# EAGLE design Door lock REV B (EAGLE 7.5.0)
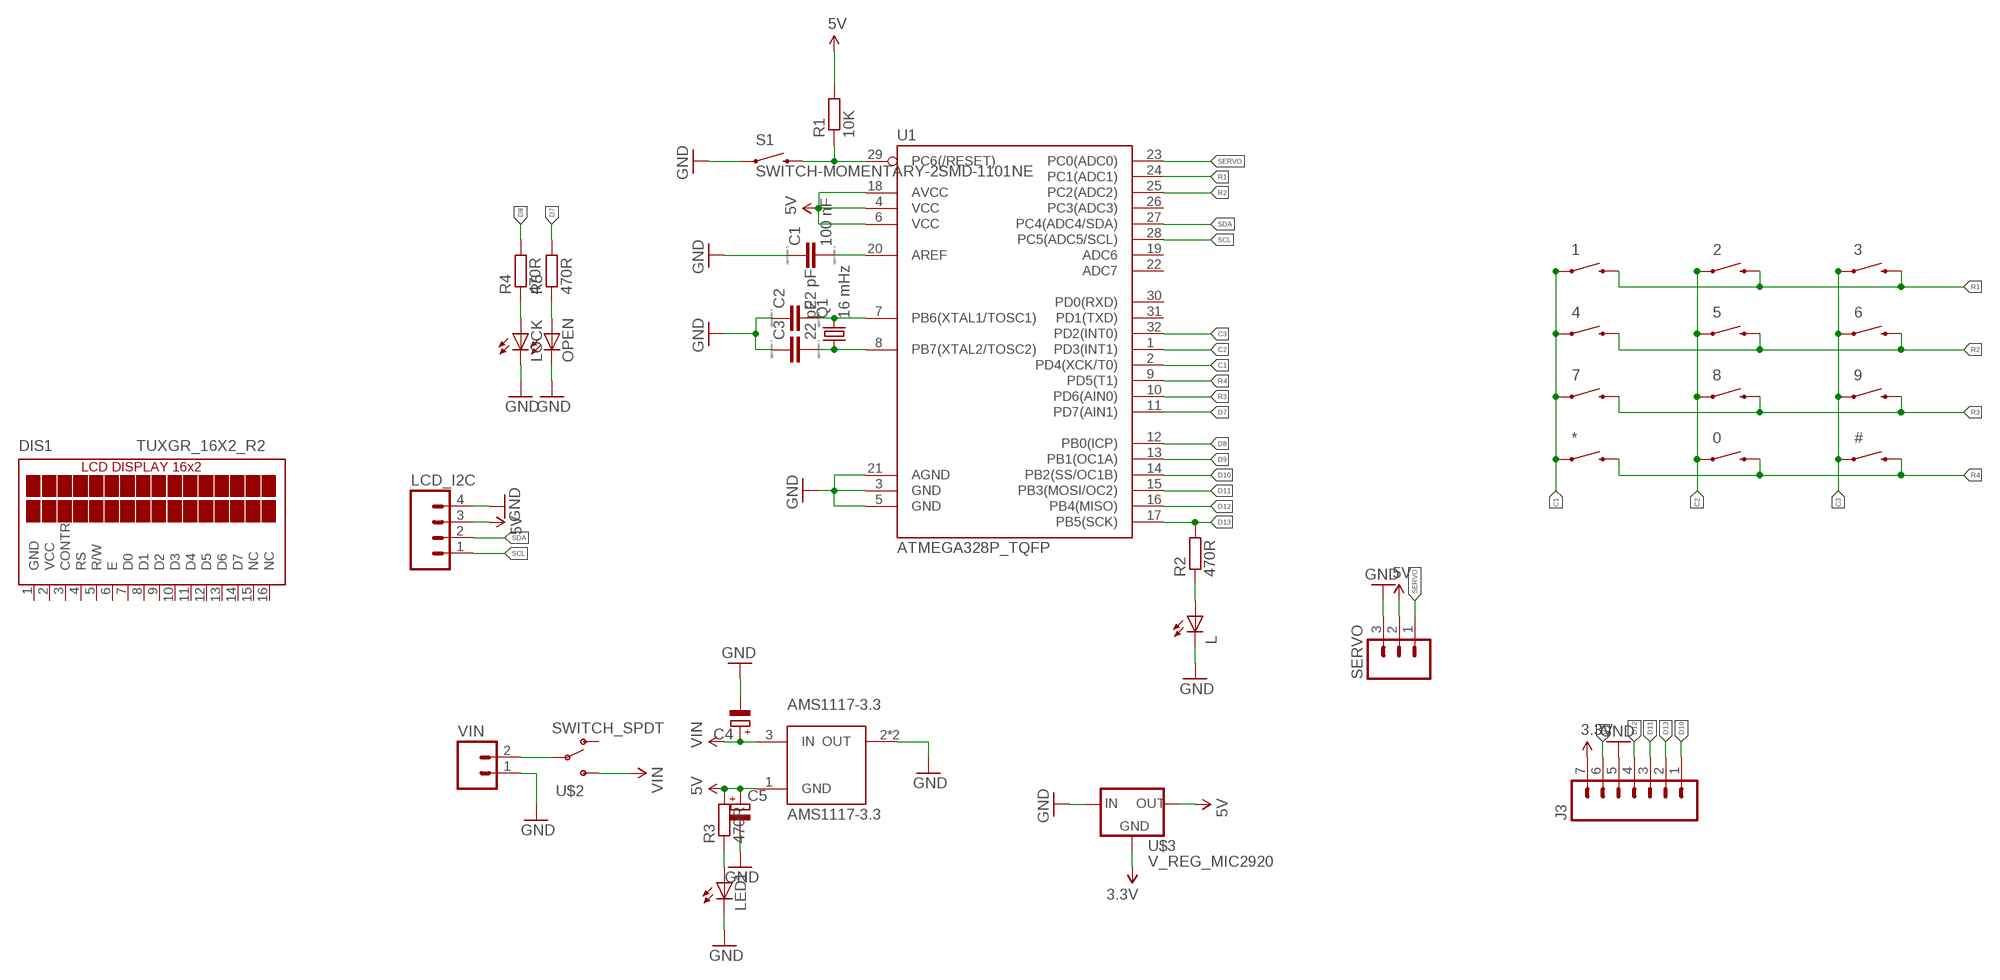
[diagram p0: schematic, sheet 1]

## Parts
0  SWITCH-MOMENTARY-2PTH  [TACTILE-PTH]
1  SWITCH-MOMENTARY-2PTH  [TACTILE-PTH]
2  SWITCH-MOMENTARY-2PTH  [TACTILE-PTH]
3  SWITCH-MOMENTARY-2PTH  [TACTILE-PTH]
4  SWITCH-MOMENTARY-2PTH  [TACTILE-PTH]
5  SWITCH-MOMENTARY-2PTH  [TACTILE-PTH]
6  SWITCH-MOMENTARY-2PTH  [TACTILE-PTH]
7  SWITCH-MOMENTARY-2PTH  [TACTILE-PTH]
8  SWITCH-MOMENTARY-2PTH  [TACTILE-PTH]
9  SWITCH-MOMENTARY-2PTH  [TACTILE-PTH]
#  SWITCH-MOMENTARY-2PTH  [TACTILE-PTH]
*  SWITCH-MOMENTARY-2PTH  [TACTILE-PTH]
AMS1117-3.3  AMS1117-3.3  AP1117Y33G-13  [SOT89]
C1  100 nF  CC0603  [C0603]
C2  22 pF  CC0603  [C0603]
C3  22 pF  CC0603  [C0603]
C4  CPOL-EUSMCA  [SMC_A]
C5  CPOL-EUSMCA  [SMC_A]
DIS1  TUXGR_16X2_R2  [TUXGR_16X2_R2]
J3  M07  [1X07]
L  LEDCHIPLED_0805  [CHIPLED_0805]
LCD_I2C  M04PTH  [1X04]
LED1  LEDCHIPLED_0805  [CHIPLED_0805]
LOCK  LED3MM  [LED3MM]
OPEN  LED3MM  [LED3MM]
Q1  16 mHz  CRYSTALHC49S  [HC49/S]
R1  10K  R-EU_R0603  [R0603]
R2  470R  R-EU_R0603  [R0603]
R3  470R  R-EU_R0603  [R0603]
R4  470R  R-EU_R0603  [R0603]
R5  470R  R-EU_R0603  [R0603]
S1  SWITCH-MOMENTARY-2SMD-1101NE  [TACTILE-SWITCH-1101NE]
SERVO  M03PTH  [1X03]
U1  ATMEGA328P_TQFP  [TQFP32-08]
U$2  SWITCH_SPDT  [KPS-1290]
U$3  V_REG_MIC2920  [SOT223]
VIN  M02PTH3  [1X02_LONGPADS]

## Nets
3.3V: J3.7 U$3.2(GND)
5V: AMS1117-3.3.1(GND) C5.+ LCD_I2C.3 R1.2 R3.2 SERVO.2 U1.4(VCC) U1.6(VCC) U1.18(AVCC) U$3.3(OUT)
C1: 1.1 4.1 7.1 *.1 U1.2(PD4(XCK/T0))
C2: 0.1 2.1 5.1 8.1 U1.1(PD3(INT1))
C3: 3.1 6.1 9.1 #.1 U1.32(PD2(INT0))
D7: R5.2 U1.11(PD7(AIN1))
D8: R4.2 U1.12(PB0(ICP))
D9: J3.6 U1.13(PB1(OC1A))
D10: J3.1 U1.14(PB2(SS/OC1B))
D11: J3.3 U1.15(PB3(MOSI/OC2))
D12: J3.4 U1.16(PB4(MISO))
D13: J3.2 R2.2 U1.17(PB5(SCK))
GND: AMS1117-3.3.2(OUT) AMS1117-3.3.2@1(OUT) C1.1 C2.1 C3.1 C4.- C5.- J3.5 L.C LCD_I2C.4 LED1.C LOCK.K(C) OPEN.K(C) S1.1 SERVO.3 U1.3(GND) U1.5(GND) U1.21(AGND) U$3.1(IN) VIN.1
N$1: L.A R2.1
N$2: LOCK.A R4.1
N$3: C3.2 Q1.1 U1.8(PB7(XTAL2/TOSC2))
N$4: C2.2 Q1.2 U1.7(PB6(XTAL1/TOSC1))
N$5: OPEN.A R5.1
N$6: C1.2 U1.20(AREF)
N$7: R1.1 S1.2 U1.29(PC6(/RESET))
N$9: LED1.A R3.1
N$11: U$2.P VIN.2
R1: 1.3 2.3 3.3 U1.24(PC1(ADC1))
R2: 4.3 5.3 6.3 U1.25(PC2(ADC2))
R3: 7.3 8.3 9.3 U1.10(PD6(AIN0))
R4: 0.3 #.3 *.3 U1.9(PD5(T1))
SCL: LCD_I2C.1 U1.28(PC5(ADC5/SCL))
SDA: LCD_I2C.2 U1.27(PC4(ADC4/SDA))
SERVO: SERVO.1 U1.23(PC0(ADC0))
VIN: AMS1117-3.3.3(IN) C4.+ U$2.S
Unconnected: DIS1.3(CONTR) DIS1.4(RS) DIS1.5(R/W) DIS1.6(E) DIS1.7(D0) DIS1.8(D1) DIS1.9(D2) DIS1.10(D3) DIS1.11(D4) DIS1.12(D5) DIS1.13(D6) DIS1.14(D7) DIS1.15(NC) DIS1.16(NC) U1.19(ADC6) U1.22(ADC7) U1.26(PC3(ADC3)) U1.30(PD0(RXD)) U1.31(PD1(TXD)) U$2.O

## Power pins joined to a net without a drawn wire
GND: DIS1.1(GND)
VCC: DIS1.2(VCC)

## Library data of the parts
0 1-9 # * = SparkFun-Electromechanical:SWITCH-MOMENTARY-2: Various NO switches- pushbuttons, reed, etc; PROD_ID: SWCH-08441
AMS1117-3.3 = AP1117Y33G-13:AP1117Y33G-13
C1-C3 = eagle-ltspice:C: CAPACITOR, European symbol; SPICEMODEL: NONE; SPICEPREFIX: C
C4 C5 = rcl:CPOL-EU: POLARIZED CAPACITOR, European symbol
DIS1 = display-lcd:TUXGR_16X2_R2: Tuxgraphics LCD display 16x2 characters reflective, without background light Source: tuxgr_12x2_r2.pdf; OC_FARNELL: unknown; OC_NEWARK: unknown
J3 = SparkFun-Connectors:M07: Header 7 Standard 7-pin 0.1" header. Use with straight break away headers (SKU : PRT-00116), right angle break away headers (PRT-00553), swiss pins (PRT-00743), machine pins (PRT-00117), and female headers (PRT-00115). NOTES ON THE VARIANTS LOCK and LOCK_LONGPADS... This footprint was designed to help hold the alignment of a through-hole component (i.e. 7-pin header) while soldering it into place. You may notice that each hole has been shifted either up or down by 0.005 of an inch from it's more standard position (which is usually a perfectly straight line). This slight alteration caused the pins (the squares in the middle) to touch the edges of the holes. Because they are alternating, it causes a "brace" to hold the header in place. 0.005 has proven to be the perfect amount of "off-center" position when using our standard breakaway headers. Although looks a little odd when you look at the bare footprint, once you have a header in there, the alteration is very hard to notice. Also, if you push a header all the way into place, it is covered up entirely on the bottom side. This idea of altering the position of holes to aid alignment will be further integrated into the Sparkfun Library for other footprints. It can help hold any component with 3 or more connection pins.
L LED1 LOCK OPEN = adafruit:LED: LED OSRAM: - CHIPLED LG R971, LG N971, LY N971, LG Q971, LY Q971, LO R971, LY R971 LH N974, LH R974 LS Q976, LO Q976, LY Q976 LO Q996 - Hyper CHIPLED LW Q18S LB Q993, LB Q99A, LB R99A - SideLED LS A670, LO A670, LY A670, LG A670, LP A670 LB A673, LV A673, LT A673, LW A673 LH A674 LY A675 LS A676, LA A676, LO A676, LY A676, LW A676 LS A679, LY A679, LG A679 - Hyper Micro SIDELED® LS Y876, LA Y876, LO Y876, LY Y876 LT Y87S - SmartLED LW L88C, LW L88S LB L89C, LB L89S, LG L890 LS L89K, LO L89K, LY L89K LS L896, LA L896, LO L896, LY L896 - TOPLED LS T670, LO T670, LY T670, LG T670, LP T670 LSG T670, LSP T670, LSY T670, LOP T670, LYG T670 LG T671, LOG T671, LSG T671 LB T673, LV T673, LT T673, LW T673 LH T674 LS T676, LA T676, LO T676, LY T676, LB T676, LH T676, LSB T676, LW T676 LB T67C, LV T67C, LT T67C, LS T67K, LO T67K, LY T67K, LW E67C LS E67B, LA E67B, LO E67B, LY E67B, LB E67C, LV E67C, LT E67C LW T67C LS T679, LY T679, LG T679 LS T770, LO T770, LY T770, LG T770, LP T770 LB T773, LV T773, LT T773, LW T773 LH T774 LS E675, LA E675, LY E675, LS T675 LS T776, LA T776, LO T776, LY T776, LB T776 LHGB T686 LT T68C, LB T68C - Hyper Mini TOPLED® LB M676 - Mini TOPLED Santana® LG M470 LS M47K, LO M47K, LY M47K Source: http://www.osram.convergy.de/
LCD_I2C = SparkFun-Connectors:M04: Header 4 Standard 4-pin 0.1" header. Use with straight break away headers (SKU : PRT-00116), right angle break away headers (PRT-00553), swiss pins (PRT-00743), machine pins (PRT-00117), and female headers (PRT-00115). Molex polarized connector foot print use with SKU : PRT-08231 with associated crimp pins and housings. 1MM SMD Version SKU: PRT-10208; PROD_ID: CONN-09696
Q1 = adafruit:CRYSTAL: CRYSTAL; OC_FARNELL: 1667008; OC_NEWARK: unknown
R1-R5 = rcl:R-EU_: RESISTOR, European symbol
S1 = SparkFun-Electromechanical:SWITCH-MOMENTARY-2: Various NO switches- pushbuttons, reed, etc; PROD_ID: SWCH-00815
SERVO = SparkFun-Connectors:M03: Header 3 Standard 3-pin 0.1" header. Use with straight break away headers (SKU : PRT-00116), right angle break away headers (PRT-00553), swiss pins (PRT-00743), machine pins (PRT-00117), and female headers (PRT-00115). Molex polarized connector foot print use with SKU : PRT-08232 with associated crimp pins and housings.
U1 = SparkFun-DigitalIC:ATMEGA328P_TQFP; PROD_ID: IC-09069
U$2 = SparkFun-Electromechanical:SWITCH_SPDT: SWCH-10651 Side-actuated SPDT slide switch, as used on the Arduino Pro; PROD_ID: SWCH-10651
U$3 = SparkFun-PowerIC:V_REG_MIC2920: MIC2920A (http://www.micrel.com/_PDF/mic2920.pdf) - 400mA output LDO Regulator
VIN = SparkFun-Connectors:M02: Standard 2-pin 0.1" header. Use with - straight break away headers ( PRT-00116) - right angle break away headers (PRT-00553) - swiss pins (PRT-00743) - machine pins (PRT-00117) - female headers (PRT-00115) Molex polarized connector foot print use with: PRT-08233 with associated crimp pins and housings. 2.54_SCREWTERM for use with PRT-10571. 3.5mm Screw Terminal footprints for PRT-08084 5mm Screw Terminal footprints for use with PRT-08432

## Board
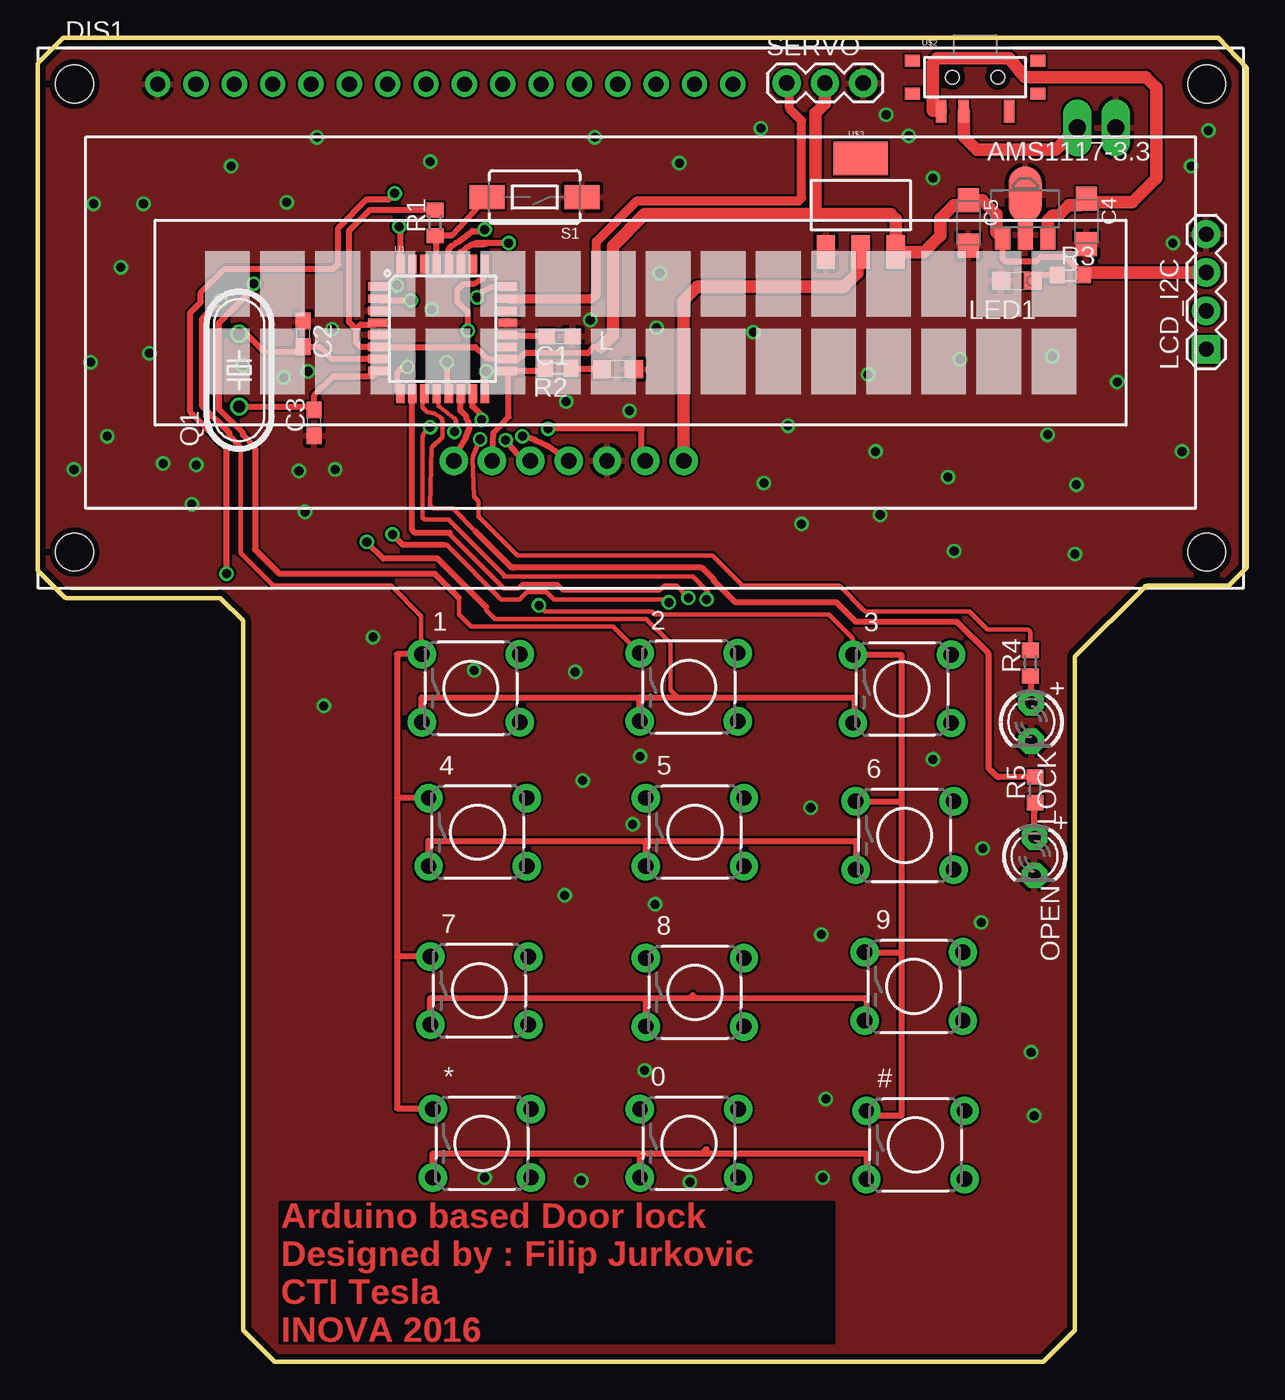
[diagram p1: board, top side]
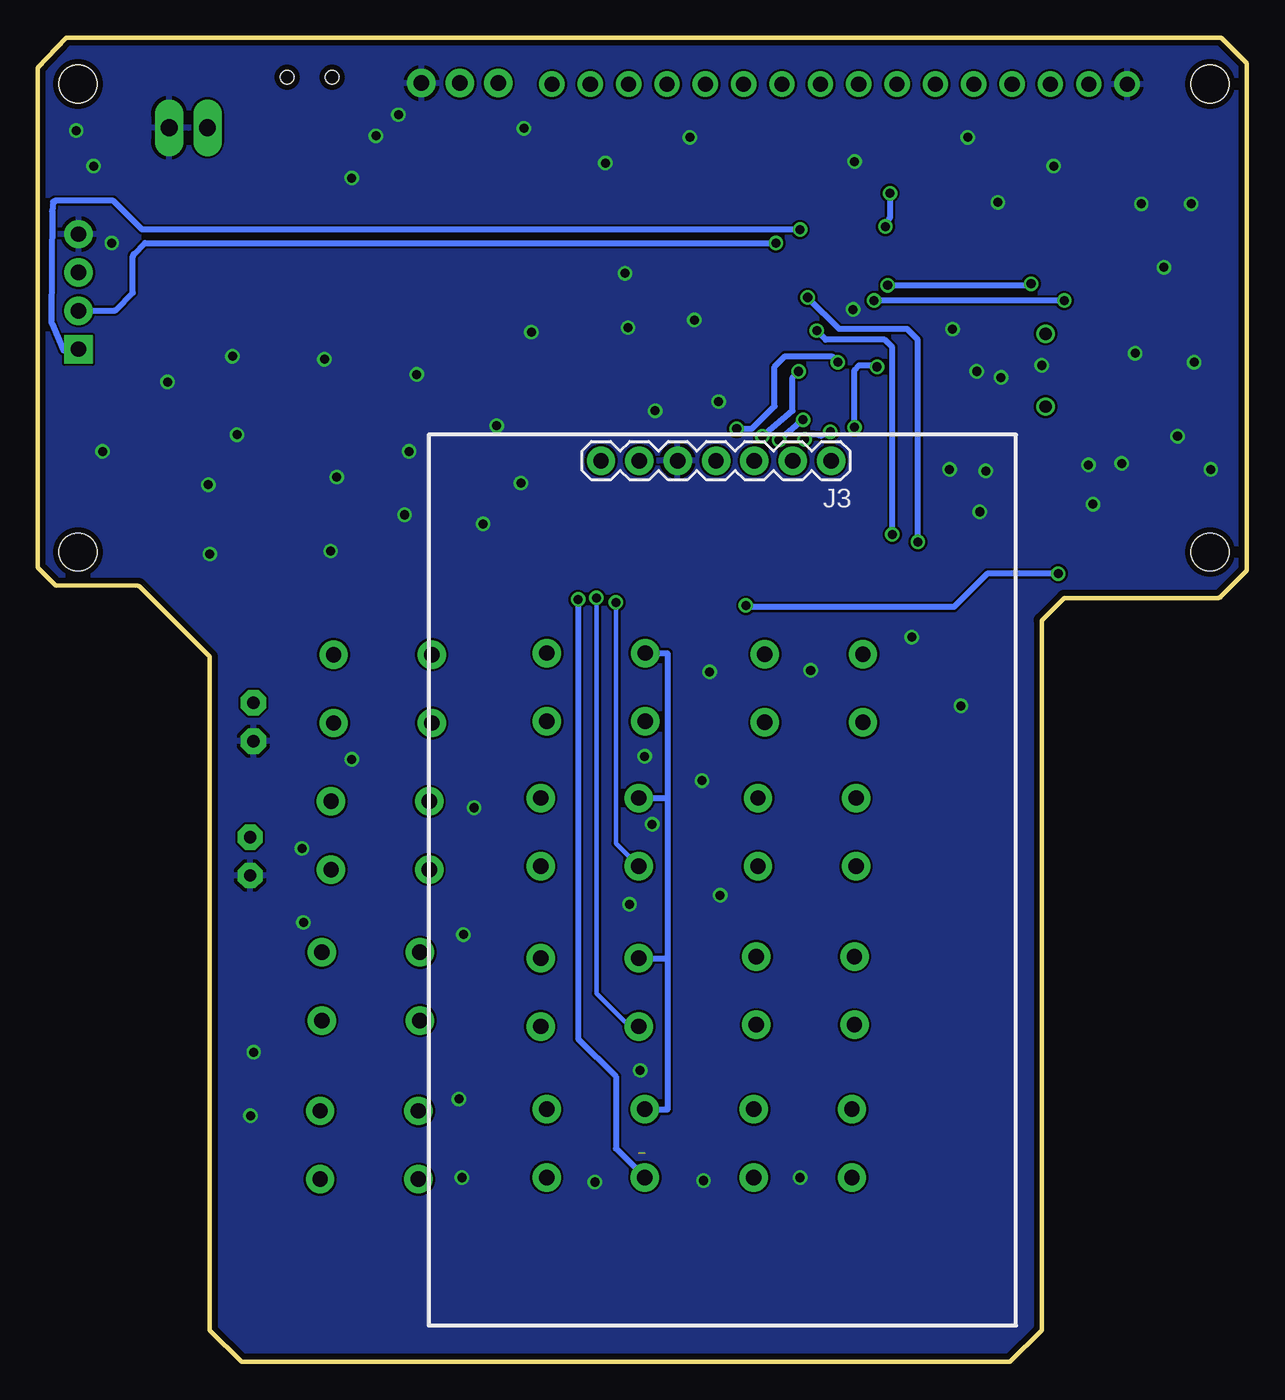
[diagram p2: board, bottom side, seen from below]

Size 80.1 x 87.7 mm. Coordinates in mm from the lower left corner, seen from the top.
Outline: 1.9,50.6 arc-45 1.73,50.67 0,52.4 0,85.89 arc-45 0.07,86.07 1.7,87.7 78.2,87.7 80.1,85.7 80.1,52.6 78.9,51.4 73.51,51.4 arc45 73.33,51.33 68.7,46.7 68.7,2.1 66.6,0 15.7,0 13.6,2.1 13.6,2.2 13.6,49.1 12.1,50.6 2,50.6
Copper layers (1*16): Top 0.0356mm / dielectric 1.5011mm / Bottom 0.0356mm
Design rules "PCBs_io": minimum track width 6mil, minimum drill 13mil, track to track 6mil, track to pad 6mil, pad to pad 6mil, via to via 6mil, smd to smd 6mil, copper to edge 15mil, drill to drill 6mil, minimum pad ring 7mil, minimum via ring 7mil, stop-mask expansion 3mil, vias tented up to drill 0mil, thermal gap 10mil

### Footprints (pad centres in the part's own frame; a part is rotated, then mirrored left to right if it is on the bottom)
TACTILE-PTH = drill 1.016 pad 1.88: 1 -3.251,2.261; 2 3.251,2.261; 3 -3.251,-2.261; 4 3.251,-2.261
SOT89 = smd 1 x 1.5: 1 -1.499,-1.981; 3 1.499,-1.981 | smd 1 x 2: 2 0,-1.727 | smd 2.2 x 3.7: 2@1 0,0.94
C0603 = smd 1.1 x 1: 1 -0.85,0; 2 0.85,0
SMC_A = smd 1.6 x 1.4: + -1.5,0; - 1.5,0
TUXGR_16X2_R2 = drill 1 pad 1.676: 1 -32,15.5; 2 -29.46,15.5; 3 -26.92,15.5; 4 -24.38,15.5; 5 -21.84,15.5; 6 -19.3,15.5; 7 -16.76,15.5; 8 -14.22,15.5; 9 -11.68,15.5; 10 -9.14,15.5; 11 -6.6,15.5; 12 -4.06,15.5; 13 -1.52,15.5; 14 1.02,15.5; 15 3.56,15.5; 16 6.1,15.5 | hole 2.5: -37.5,-15.5; 37.5,-15.5; -37.5,15.5; 37.5,15.5
1X07 = drill 1.016 pad 1.88: 1 0,0; 2 2.54,0; 3 5.08,0; 4 7.62,0; 5 10.16,0; 6 12.7,0; 7 15.24,0
CHIPLED_0805 = smd 1.2 x 1.2: A 0,-1.05; C 0,1.05
1X04 = drill 1.016 pad 1.88 square: 1 0,0 | drill 1.016 pad 1.88: 2 2.54,0; 3 5.08,0; 4 7.62,0
LED3MM = drill 0.813 pad 1.676 octagon: A -1.27,0; K 1.27,0
HC49/S = drill 0.813: 1 -2.413,0; 2 2.413,0
R0603 = smd 1 x 1.1: 1 -0.85,0; 2 0.85,0
TACTILE-SWITCH-1101NE = smd 2.3 x 1.6: 1 -3.15,0; 2 3.15,0
1X03 = drill 1.016 pad 1.88: 1 0,0; 2 2.54,0; 3 5.08,0
TQFP32-08 = smd 1.27 x 0.559: 1 -4.293,2.8; 2 -4.293,2; 3 -4.293,1.2; 4 -4.293,0.4; 5 -4.293,-0.4; 6 -4.293,-1.2; 7 -4.293,-2; 8 -4.293,-2.8; 17 4.293,-2.8; 18 4.293,-2; 19 4.293,-1.2; 20 4.293,-0.4; 21 4.293,0.4; 22 4.293,1.2; 23 4.293,2; 24 4.293,2.8 | smd 0.559 x 1.27: 9 -2.8,-4.293; 10 -2,-4.293; 11 -1.2,-4.293; 12 -0.4,-4.293; 13 0.4,-4.293; 14 1.2,-4.293; 15 2,-4.293; 16 2.8,-4.293; 25 2.8,4.293; 26 2,4.293; 27 1.2,4.293; 28 0.4,4.293; 29 -0.4,4.293; 30 -1.2,4.293; 31 -2,4.293; 32 -2.8,4.293
KPS-1290 = smd 0.7 x 1.5: O -2.25,2.25; P 0.75,2.25; S 2.25,2.25 | smd 1 x 0.8: P$1 -4.15,1.1; P$2 -4.15,-1.1; P$3 4.15,-1.1; P$4 4.15,1.1 | hole 0.9: -1.5,0; 1.5,0
SOT223 = smd 1.219 x 2.235: 1 -2.311,-3.099; 2 0,-3.099; 3 2.311,-3.099 | smd 3.6 x 2.2: 4 0,3.099
1X02_LONGPADS = drill 1.118 pad 1.88 long: 1 0,0; 2 2.54,0

### Placement (x,y rotation side)
0  43.14,14.47 0 top
1  28.69,44.61 0 top
2  43.12,44.68 0 top
3  57.25,44.57 0 top
4  29.14,35.08 0 top
5  43.53,35.08 0 top
6  57.42,34.86 0 top
7  29.25,24.58 0 top
8  43.53,24.47 0 top
9  58.03,24.86 0 top
#  58.14,14.36 0 top
*  29.42,14.47 0 top
AMS1117-3.3  65.41,76.38 0 top
C1  34.58,67.92 180 top
C2  17.58,68.09 270 top
C3  18.32,62.2 90 top
C4  69.46,75.53 270 top
C5  61.65,75.43 270 top
DIS1  39.94,69.13 0 top
J3  27.55,59.68 180 bottom
L  38.43,65.75 270 top
LCD_I2C  77.4,67.07 90 top
LED1  64.87,71.6 90 top
LOCK  65.81,42.38 270 top
OPEN  66.03,33.48 270 top
Q1  13.34,65.68 90 top
R1  26.32,75.44 90 top
R2  34.47,65.82 180 top
R3  68.4,71.98 0 top
R4  65.75,46.28 90 top
R5  66.06,37.88 90 top
S1  32.91,77.15 180 top
SERVO  49.6,84.7 0 top
U1  26.82,68.42 0 top
U$2  62.09,85.08 180 top
U$3  54.52,76.61 0 top
VIN  71.4,81.73 180 top

### Tracks (layer width: path | path; a pad name or v marks a point on that pad's centre or on a via)
3.3V
  Top 0.813: J3.7 42.79,70.29 43.7,71.2 53.4,71.2 54.3,72.1 54.3,73.29 U$3.2
5V
  Top 0.406: 21.1,68.4 21.1,67.5 21.38,67.22 U1.6 28.98,67.22 29.6,66.6 29.83,66.45 U1.18 31.23,66.3 31.7,66.3 32.25,66.8 36.45,66.8 36.8,67.2 37.3,67.2 | 21.1,68.4 21.4,68.7 22.41,68.7 U1.4 | R1.2 21.99,76.29 20.6,74.9 20.6,68.9 21.1,68.4 | AMS1117-3.3.1 63.91,73.09 64.1,72.9 66.15,72.9 66.45,73.2 68.03,73.2 R3.2
  Top 0.813: AMS1117-3.3.1 63.5,74.81 63.5,76 62.57,76.93 C5.+ 61.32,76.6 60.7,76.6 59.8,75.7 59.8,74.6 58.71,73.51 U$3.3 56.83,75.67 56.5,76 51.8,76 | 51.8,76 40.2,76 38.1,73.9 38.1,68 37.3,67.2 | LCD_I2C.3 69.42,72.15 R3.2 | SERVO.2 52.14,83.34 51.5,82.7 51.5,76.3 51.8,76
C1  (via drill 0.6)
  Top 0.305: 13.44,60.56 13.44,53.56 15.6,51.4 23.4,51.4 25.4,49.4 25.4,46.91 1.1
  Top 0.406: 1.1 23.8,46.87 23.8,37.34 | 23.8,37.34 23.8,26.84 | 23.8,26.84 23.8,16.8 26.17,16.8 *.1 | 7.1 23.8,26.84 | 4.1 23.8,37.34 | 13.44,60.56 12.7,61.3 12.7,61.5 10.9,63.3 10.9,69.1 v12.1,70.3 | v24.7,70.3 22.65,70.3 U1.2
  Bottom 0.406: v12.1,70.3 v24.7,70.3
C2  (via drill 0.6)
  Top 0.305: 27.9,50.6 27.9,49.5 28.7,48.7 38.11,48.7 2.1
  Top 0.406: U1.1 23.72,71.22 v23.8,71.3 | v14.3,71.4 14.3,71.1 12,68.8 12,63.1 13.6,61.5 13.6,61.4 14.4,60.6 14.4,53.8 16,52.2 26.3,52.2 27.9,50.6 | 39.9,46.97 2.1
  Bottom 0.406: 2.1 38.4,46.94 38.4,37.34 | 38.4,37.34 38.4,26.73 | 38.4,26.73 38.4,16.7 39.89,16.7 0.1 | 8.1 38.4,26.73 | 5.1 38.4,37.34 | v23.8,71.3 14.4,71.3 v14.3,71.4
C3  (via drill 0.6)
  Top 0.305: 3.1 54,47.9 52.4,49.5 40.9,49.5 40.7,49.7 33.6,49.7 v33.2,50.1
  Top 0.406: 3.1 57.2,46.83 57.2,37.12 | 57.2,37.12 57.2,27.12 | 57.2,27.12 57.2,16.3 54.89,16.3 #.1 | 9.1 57.2,27.12 | 6.1 57.2,37.12 | v12.5,52.2 12.5,60.5 10.1,62.9 10.1,69.5 10.8,70.2 10.8,70.8 12.4,72.4 19.6,72.4 19.9,72.7 19.9,75.1 21.8,77 23.25,77 v23.65,77.4 | U1.32 24,72.73 24,74.8 23.95,74.85 v23.95,75.2
  Bottom 0.406: v12.5,52.2 17.2,52.2 19.4,50 33.1,50 v33.2,50.1 | v23.65,77.4 23.65,75.8 v23.95,75.2
D7
  Top 0.305: 29,55 27.5,56.5 26.3,56.5 arc-45 26.13,56.57 26,56.7 26.1,60.55 26.8,61.25 26.8,62.3 arc45 26.68,62.57 26.3,62.8 25.9,62.9 arc-45 25.73,62.97 25.5,63.2 25.5,63.9 arc-45 25.57,64.08 U1.11
  Top 0.406: R5.2 63.67,38.73 arc-45 63.5,38.8 63,39.3 63,46.8 arc45 62.93,46.97 60.9,49 54.3,49 arc-45 54.13,49.07 52.9,50.3 46.3,50.3 arc-45 46.13,50.37 44.8,51.7 arc45 44.73,51.87 44,52.6 31.5,52.6 arc-45 31.33,52.67 29,55
D8  (via drill 0.6)
  Top 0.305: R4.2 65.75,48.25 arc45 65.68,48.42 65.6,48.5 63,48.5 arc-45 62.83,48.57 61.7,49.7 54.91,49.7 arc-45 54.73,49.77 53.1,51.4 46.8,51.4 arc-45 46.63,51.47 44.7,53.4 31.91,53.4 arc-45 31.73,53.47 29.2,56 29.2,56.9 arc45 29.13,57.07 28.9,57.3 28.8,59.8 arc45 28.83,59.97 v29.3,61.1 | v27.6,61.6 27.7,62.3 arc45 27.63,62.47 26.55,63.3 26.5,63.84 arc45 26.53,64.02 U1.12
  Bottom 0.305: v29.3,61.1 29.3,61.3 arc45 28.23,61.27 v27.6,61.6
D9  (via drill 0.6)
  Top 0.406: J3.6 40.25,59.65 40,59.9 40,61.8 v33.8,61.8 | v27.1,66.2 27.1,64.25 U1.13
  Bottom 0.406: v33.8,61.8 32.8,61.8 31.3,63.3 31.3,65.9 30.6,66.6 27.5,66.6 v27.1,66.2
D10
  Top 0.406: J3.1 27.55,60.35 27.74,60.35 arc45 27.92,60.42 28.35,61.15 28.55,61.7 arc45 28.58,62.07 28.5,62.3 28.4,62.5 arc45 28.33,62.67 28,63 28,64.11 U1.14
D11  (via drill 0.6)
  Top 0.406: J3.3 31.83,60.07 v31,61.05 | v29.4,62.4 29.4,62.7 28.8,63.3 28.8,64.11 U1.15
  Bottom 0.406: v31,61.05 v29.4,62.4
D12  (via drill 0.6)
  Top 0.406: J3.4 33.72,60.68 33,61 32.5,61.2 v32.1,61.3 | v29.7,65.6 29.65,65.6 29.6,65.5 29.6,64.45 U1.16
  Bottom 0.406: v32.1,61.3 30.1,63 30.1,65.2 v29.7,65.6
D13
  Top 0.406: R2.2 33.11,65.62 U1.17 31.2,65.53 31.2,62.6 30.19,61.54 J3.2
GND  (via drill 0.6)
  other vias: 26.1,69.7 19.5,68.4 19.7,59.1 36.6,69 17.3,59 17.7,56.3 10.2,56.8 8.3,59.5 10.5,59.4 22.2,48 28.9,45.8 18.95,43.45 35.6,45.7 36.1,38.5 34.9,30.9 51.9,28.3 51.2,36.7 62.5,29.1 62.6,34 52.2,17.4 52,12.2 43.2,11.9 36,12 29.6,12.2 66,16.3 65.8,20.5 59.3,39.9 68.7,53.5 60.7,53.7 55.8,56.1 66.9,61.4 75.8,60.3 68.8,58.1 60.3,58.6 55.5,60.3 48.1,58.2 50.6,55.5 49.7,62 55,65.4 61.1,66.4 67.2,66.6 71.5,64.9 47.4,68.2 39.2,63 35,63.6 41,68.5 41.2,72.1 59.3,78.4 57.7,81.2 56.2,82.6 77.55,81.55 76.4,79.2 75.2,74.1 42.5,79.4 47.9,81.7 36.9,81.1 26,79.5 18.5,81.1 16.5,76.8 12.8,79.2 7,76.7 5.5,72.5 3.5,66.2 4.6,61.3 2.4,59.1 7.4,66.8 3.7,76.7 40.9,30.3 40.2,19.3 39.9,40.1 39.4,35.6 13.6,66 16.3,65.2 17.9,65.6
  pour Top: -0.8,87.8 101.5,87.5 100.4,-6.2 -1.5,-6
  pour Bottom: -0.8,87.5 100.4,87.7 102.5,-7 0.4,-7.1
N$1
  Top 0.406: L.A 35.39,65.75 R2.1
N$2
  Top 0.406: LOCK.A 65.81,45.37 R4.1
N$3
  Top 0.406: Q1.1 18.1,63.27 C3.2 18.32,64.02 19.6,65.3 22.21,65.3 U1.8
N$4
  Top 0.406: Q1.2 13.81,68.09 15,66.9 17.24,66.9 C2.2 17.62,67.2 18.7,67.2 19.48,66.42 U1.7
N$5
  Top 0.406: OPEN.A 66.03,36.4 R5.1
N$6
  Top 0.406: C1.2 31.21,67.92 U1.20
N$7
  Top 0.406: U1.29 26.42,74.49 R1.1 27.43,74.6 27.9,75.1 S1.2
N$9
  Top 0.406: R3.1 66.3,71.98 LED1.A
N$11
  Top 0.813: U$2.P 61.34,81.16 62.2,80.3 67.43,80.3 VIN.2
R1  (via drill 0.6)
  Top 0.305: 29.7,50 29.7,49.8 30.3,49.2 40.3,49.2 41.9,47.6 41.9,44.5 42.4,44
  Top 0.406: 1.3 25.44,44 39.87,44 | 39.87,44 42.4,44 54.1,44 54.1,42.31 3.3 | 2.3 39.87,44 | 29.7,50 26.5,53.2 22.9,53.2 v21.8,54.3 | v29.1,70.5 29.1,70.7 30.15,71.2 31.09,71.2 U1.24
  Bottom 0.406: v21.8,54.3 21.8,67.7 22.5,68.4 27,68.4 v29.1,70.5
R2  (via drill 0.6)
  Top 0.305: 26.9,54.1 27.1,54.1 30.7,50.5 31.9,50.5 32.4,51 33.7,51 34.2,50.5 41.6,50.5 v41.8,50.3
  Top 0.406: 4.3 25.89,34.5 40.28,34.5 | 40.28,34.5 54.2,34.5 54.2,32.6 6.3 | 5.3 40.28,34.5 | 26.9,54.1 24.2,54.1 v23.5,54.8 | v28.5,68.3 28.5,69.5 27.8,70.2 27.8,71 28.2,71.4 28.9,71.4 29.5,71.75 29.6,72.05 29.6,72.69 U1.25
  Bottom 0.305: v41.8,50.3 41.8,34.34 5.3
  Bottom 0.406: v23.5,54.8 23.5,67.2 24,67.7 27.9,67.7 v28.5,68.3
R3  (via drill 0.6)
  Top 0.305: 25,54.9 27.2,54.9 30.9,51.2 31.8,51.2 32.1,51.5 34.4,51.5 34.8,51.1 41.2,51.1 41.5,51.4 42.3,51.4 v43.1,50.6
  Top 0.406: 7.3 26,24.1 40.28,24.1 | 43.2,24.1 54.9,24.1 54.9,22.6 9.3 | 8.3 40.28,24.1 | 40.28,24.1 43.2,24.1 | 43.2,24.1 43.4,24.3 | 27.3,54.9 25,54.9 24.8,55.1 24.8,64.11 U1.10
  Bottom 0.305: v43.1,50.6 43.1,24.4 41.2,22.5 40.57,22.5 8.3
R4  (via drill 0.6)  (1 unrouted)
  Top 0.305: v44.3,50.5 44.4,50.6 44.4,51 43.4,52 30.9,52 arc45 30.83,52.17 27.2,55.8 25.7,55.8 arc-45 25.53,55.87 25.5,55.9 25.5,61.3 arc-45 25.57,61.47 v26,61.9
  Top 0.406: *.3 26.17,13.8 39.89,13.8 | 39.89,13.8 54.9,13.8 #.3 | 0.3 39.89,13.8 | 40.3,13.8 44,13.8 44.3,14.1 | v24.5,65.9 24.2,65.9 23.8,65.5 23.8,64.35 U1.9
  Bottom 0.406: v26,61.9 26,65.7 25.7,66 24.6,66 v24.5,65.9 | v44.3,50.5 44.3,21.4 41.8,18.9 41.8,14.12 0.3
SCL  (via drill 0.6)
  Top 0.406: U1.28 27.22,73.62 arc-45 27.29,73.79 27.4,73.9 27.7,74.1 arc45 27.97,74.27 28.8,74.9 29.39,74.9 arc45 29.57,74.97 v29.6,75
  Bottom 0.406: v29.6,75 73.09,75 arc45 73.27,75.07 75.1,76.9 78.9,76.9 arc-45 79.07,76.83 79.15,76.2 79.2,68.91 arc-45 79.13,68.73 78.4,67 77.57,67 arc-45 LCD_I2C.1
SDA  (via drill 0.6)
  Top 0.406: v31.2,74.1 29.7,74.1 | 29.3,74.1 29.1,74.1 arc45 28.93,74.03 29.4,74.03 | 29.3,74.1 arc45 28.23,73.63 28,73.5 28,72.76 arc45 U1.27 | 29.4,74.03 29.52,74.03 arc45 29.7,74.1 | 29.7,74.1 29.3,74.1 | 29.3,74.1 arc-45 29.34,74.09 29.4,74.03
  Bottom 0.406: LCD_I2C.2 75.09,69.61 arc-45 74.92,69.68 73.8,70.8 73.8,73.2 arc45 73.73,73.37 73,74.1 v31.2,74.1
SERVO
  Top 0.61: U1.23 36.72,70.42 37,70.7 37,74.2 39.7,76.9 50.4,76.9 50.6,77.1 50.6,82.2 49.8,83 49.8,84.5 SERVO.1
VIN
  Top 0.813: U$2.S 59.29,82.86 59.3,84.9 59.3,86 59.55,86.35 64.35,86.35 65.4,85.1 73.4,85.1 74.1,84.4 74.1,78.4 72.5,76.8 69.69,76.8 C4.+ 69.03,76.6 68.3,76.6 67.6,75.9 67.2,75.9 66.91,75.61 AMS1117-3.3.3

### Text on the board
Top: Arduino based Door lock / Designed by : Filip Jurkovic / CTI Tesla / INOVA 2016